# Altium schematic sheet HPREF-NOSW.SCHDOC
size B
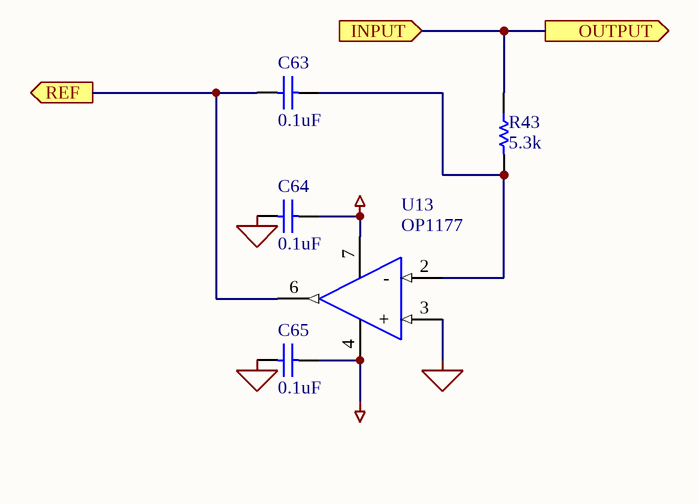
[diagram p0: HPREF-NOSW.SCHDOC]

## Parts
C63  value 0.1uF  [CC3216-1206]  (hidden comment: Cap)
C64  value 0.1uF  [CC1608-0603]  (hidden comment: Cap)
C65  value 0.1uF  [CC1608-0603]  (hidden comment: Cap)
R43  value 5.3k  [CC2012-0805]  (hidden comment: Res1)
U13  OP1177  [SO-G8/X.6]

## Ports
INPUT (in), OUTPUT (out), REF (out)

## Nets
AGND: C64.1 C65.1 U13.3(+)
AVDD: C64.2 U13.7(+Vs)
AVSS: C65.2 U13.4(-Vs)
INPUT: R43.1 ; port INPUT, port OUTPUT
REF: C63.2 U13.6(Out) ; port REF
NetC63_1: C63.1 R43.2 U13.2(-)

## Library data of the parts
C63-C65 = Cap: Capacitor; Manufacturer: Generic Components; Class I: Passive; Published: 8-Jun-2000; Revision: July-2002: Re-released for DXP Platform.; Publisher: Altium Limited; Class II: Capacitor
R43 = Res1: Resistor; Manufacturer: Generic Components; Class I: Passive; Published: 8-Jun-2000; Revision: July-2002: Re-released for DXP Platform.; Publisher: Altium Limited; Class II: Resistor
U13 = OP1177: AD Precision Low Noise, Low Input Bias Current Operational Amplifier